# Altium schematic sheet doubler.SchDoc
size A; SheetNumber: 6; SheetTotal: 9
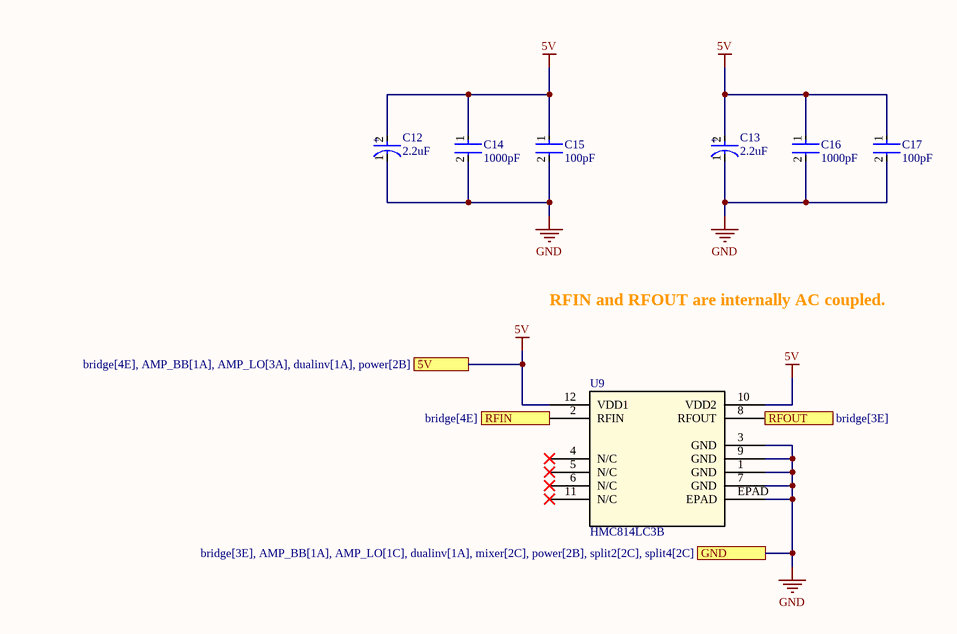
[diagram p0: doubler.SchDoc]

## Parts
C12  2.2uF  [FP-TAJA-MFG]
C13  2.2uF  [FP-TAJA-MFG]
C14  1000pF  [FP-C0603C-CF-MFG]
C15  100pF  [FP-CL05-MFG]
C16  1000pF  [FP-C0603C-CF-MFG]
C17  100pF  [FP-CL05-MFG]
U9  HMC814LC3B  [HCP_12_1]

## Ports
5V (see bridge[4E], AMP_BB[1A], AMP_LO[3A], dualinv[1A], power[2B]), GND (see bridge[3E], AMP_BB[1A], AMP_LO[1C], dualinv[1A], mixer[2C], power[2B], split2[2C], split4[2C]), RFIN (in, see bridge[4E]), RFOUT (out, see bridge[3E])

## Nets
5V: C12.2(A) C13.2(A) C14.1 C15.1 C16.1 C17.1 U9.10(VDD2) U9.12(VDD1) ; port 5V
GND: C12.1(C) C13.1(C) C14.2 C15.2 C16.2 C17.2 U9.1(GND) U9.3(GND) U9.7(GND) U9.9(GND) U9.EPAD ; port GND
RFIN: U9.2(RFIN) ; port RFIN
RFOUT: U9.8(RFOUT) ; port RFOUT

Not connected (* = marked no-connect by the designer): U9 4(N/C)* 5(N/C)* 6(N/C)* 11(N/C)*

## Notes on the sheet
- RFIN and RFOUT are internally AC coupled.
- (in symbol CMP-04424-000432-1) +

## Library data of the parts
C12 C13 = CMP-04424-000432-1: 2.2uF 16V  ±10% 6.5Ω 1206  SMD Tantalum Capacitor; Manufacturer: KYOCERA AVX; Part Number: TAJA225K016RNJ; Polarity: Polar; Leakage Current: 500nA; Dissipation Factor: 6%; ESR (Equivalent Series Resistance): 6.5R; Q Factor: 6; Series: TAJ; Number of Pins: 2; Termination: SMD/SMT; Construction: Flat; Min Operating Temperature: -55°C; Capacitance: 2.2uF; Voltage Rating: 16V; Dielectric Material: Tantalum; Radiation Hardening: No; Package Quantity: 1; Depth: 1.6mm; Features: General Purpose; Max Operating Temperature: 125°C; Height: 1.6mm; Height - Seated (Max): 0.071inch; Tolerance: 10%; Voltage Rating (DC): 16V; Width: 1.6mm; Mount: Surface Mount; Packaging: Tape and Reel; Lead Free: Lead Free; RoHS Compliant: Yes; Length: 3.2mm; Case/Package: 1206; REACH SVHC: No SVHC; Case Code (Metric): 3216; Case Code (Imperial): 1206; Voltage: 16V; Supplier 1: Future Electronics; Supplier Part Number 1: 1352210
C14 C16 = CMP-2006-03022-3: CAP CER 1000PF 50V C0G/NP0 0603; Manufacturer: Murata; Part Number: GRM1885C1H102JA01D; Value: 1,000 pF; Material: Ceramic; ComponentLink2URL: https://api.kemet.com/component-edge/download/datasheet/C0603C100J5GACAUTO.pdf; Capacitance: 1,000 pF; Temperature Range High: +125°C; Voltage Rating: 50 V; Mouser Description: Capacitor; Ceramic; Cap; 1000pF; Tol 10%; SMT; Vol-Rtg 50V; X7R; Tape and Reel; Category: Cap; ComponentLink2Description: Datasheet; Supplier 1: Arrow Electronics; Supplier Part Number 1: GRM1885C1H102JA01D
C15 C17 = CMP-13271-000010-1: CAP CER 100PF 50V C0G/NP0 0402; Manufacturer: Murata; Part Number: GCM1555C1H101JA16D; Material: Ceramic; Temperature Coefficient: 30ppm/°C; Capacitance: 100pF; ComponentLink2URL: http://www.samsungsem.com/global/front/downloadcms.do?path=%2F%2Fglobal%2F%2Fsupport%2F%2Fproduct-search%2F%2Fmlcc%2F%2F__icsFiles%2F%2Fafieldfile%2F%2F2019%2F%2F06%2F%2F18&fileName=CL05C101JB5NNNC-19.pdf; Temperature: -55°C to +125°C; Device Class L2: Capacitors; Digikey Description: CAP CER 100PF 50V C0G/NP0 0402; Value: 100pF; Temperature Range High: +125°C; Temperature Range Low: -55°C; ComponentLink2Description: Datasheet; Device Class L3: Ceramic Capacitors; Height: 0.55mm; Voltage Rating: 50V; Category: Cap; Supplier 1: Digikey; Supplier Part Number 1: 1276-1025-1-ND
U9 = HMC814LC3B: SMT GaAs MMIC x2 ACTIVE FREQUENCY / MULTIPLIER, 13 - 24.6 GHz OUTPUT; pin to pad: EPAD>13; Manufacturer: Analog Devices; RefDes: RefDes; Supplier 1: Mouser; Supplier Part Number 1: 584-HMC814LC3B; Part Number: HMC814LC3B